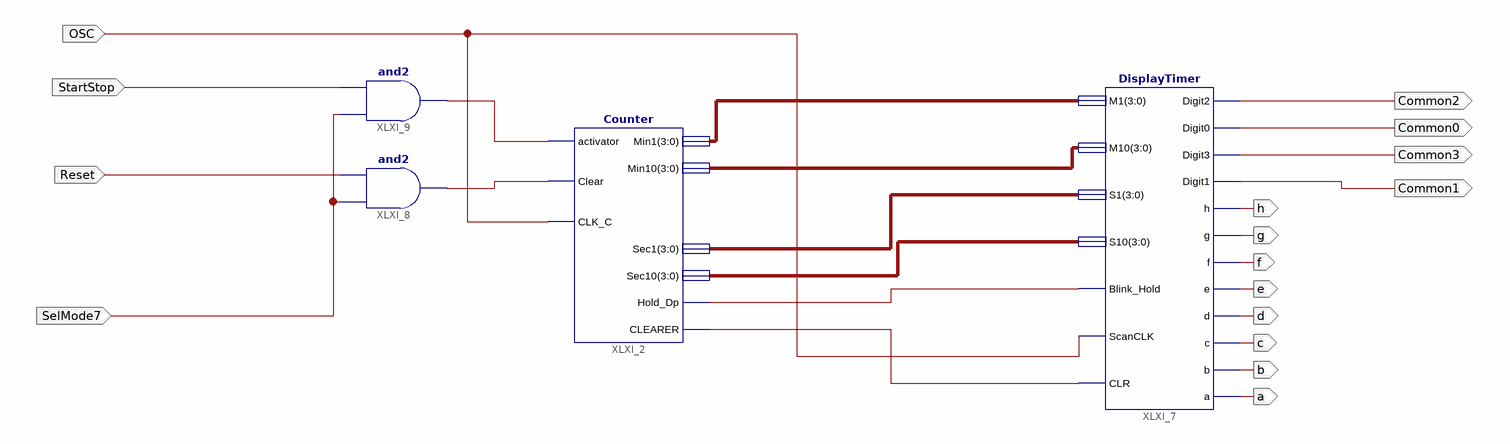
[diagram p0: schematic sheet 1]
// Xilinx ISE schematic Lab7.sch (spartan6) as structural Verilog: 4 symbols, 16 ports
module Lab7 (
  input  OSC,
  input  Reset,
  input  StartStop,
  input  SelMode7,
  output Common2,
  output h,
  output a,
  output b,
  output c,
  output d,
  output e,
  output f,
  output g,
  output Common3,
  output Common0,
  output Common1
);

  wire XLXN_89, XLXN_91, XLXN_111, XLXN_112;
  wire [3:0] XLXN_3, XLXN_4, XLXN_87, XLXN_88;

  Counter XLXI_2 (
    .activator(XLXN_112), .Clear(XLXN_111), .CLK_C(OSC), .CLEARER(XLXN_91), .Sec10(XLXN_88), .Min1(XLXN_4),
    .Min10(XLXN_3), .Sec1(XLXN_87), .Hold_Dp(XLXN_89));
  DisplayTimer XLXI_7 (
    .M1(XLXN_4), .M10(XLXN_3), .S1(XLXN_87), .S10(XLXN_88), .Blink_Hold(XLXN_89), .ScanCLK(OSC),
    .CLR(XLXN_91), .Digit2(Common2), .Digit0(Common0), .Digit3(Common3), .Digit1(Common1), .h(h), .g(g),
    .f(f), .e(e), .d(d), .c(c), .b(b), .a(a));
  and XLXI_8 (XLXN_111, SelMode7, Reset);
  and XLXI_9 (XLXN_112, SelMode7, StartStop);
endmodule
